# EasyEDA Pro project ProDoc_WCH-LinkW-R0-1v2_2024-12-16.epro

# Schematic WCH-LinkW-R0-1v2
Board Name: WCH-LinkW-R0-1v2; Create Date: 2024-08-13; Page Name: P1; Project Name: WCH_LINK; Schematic Name: WCH-LinkW-R0-1v2; Update Date: 2024-08-14; Company: 嘉立创EDA; Page Size: A3; Version: V1.0
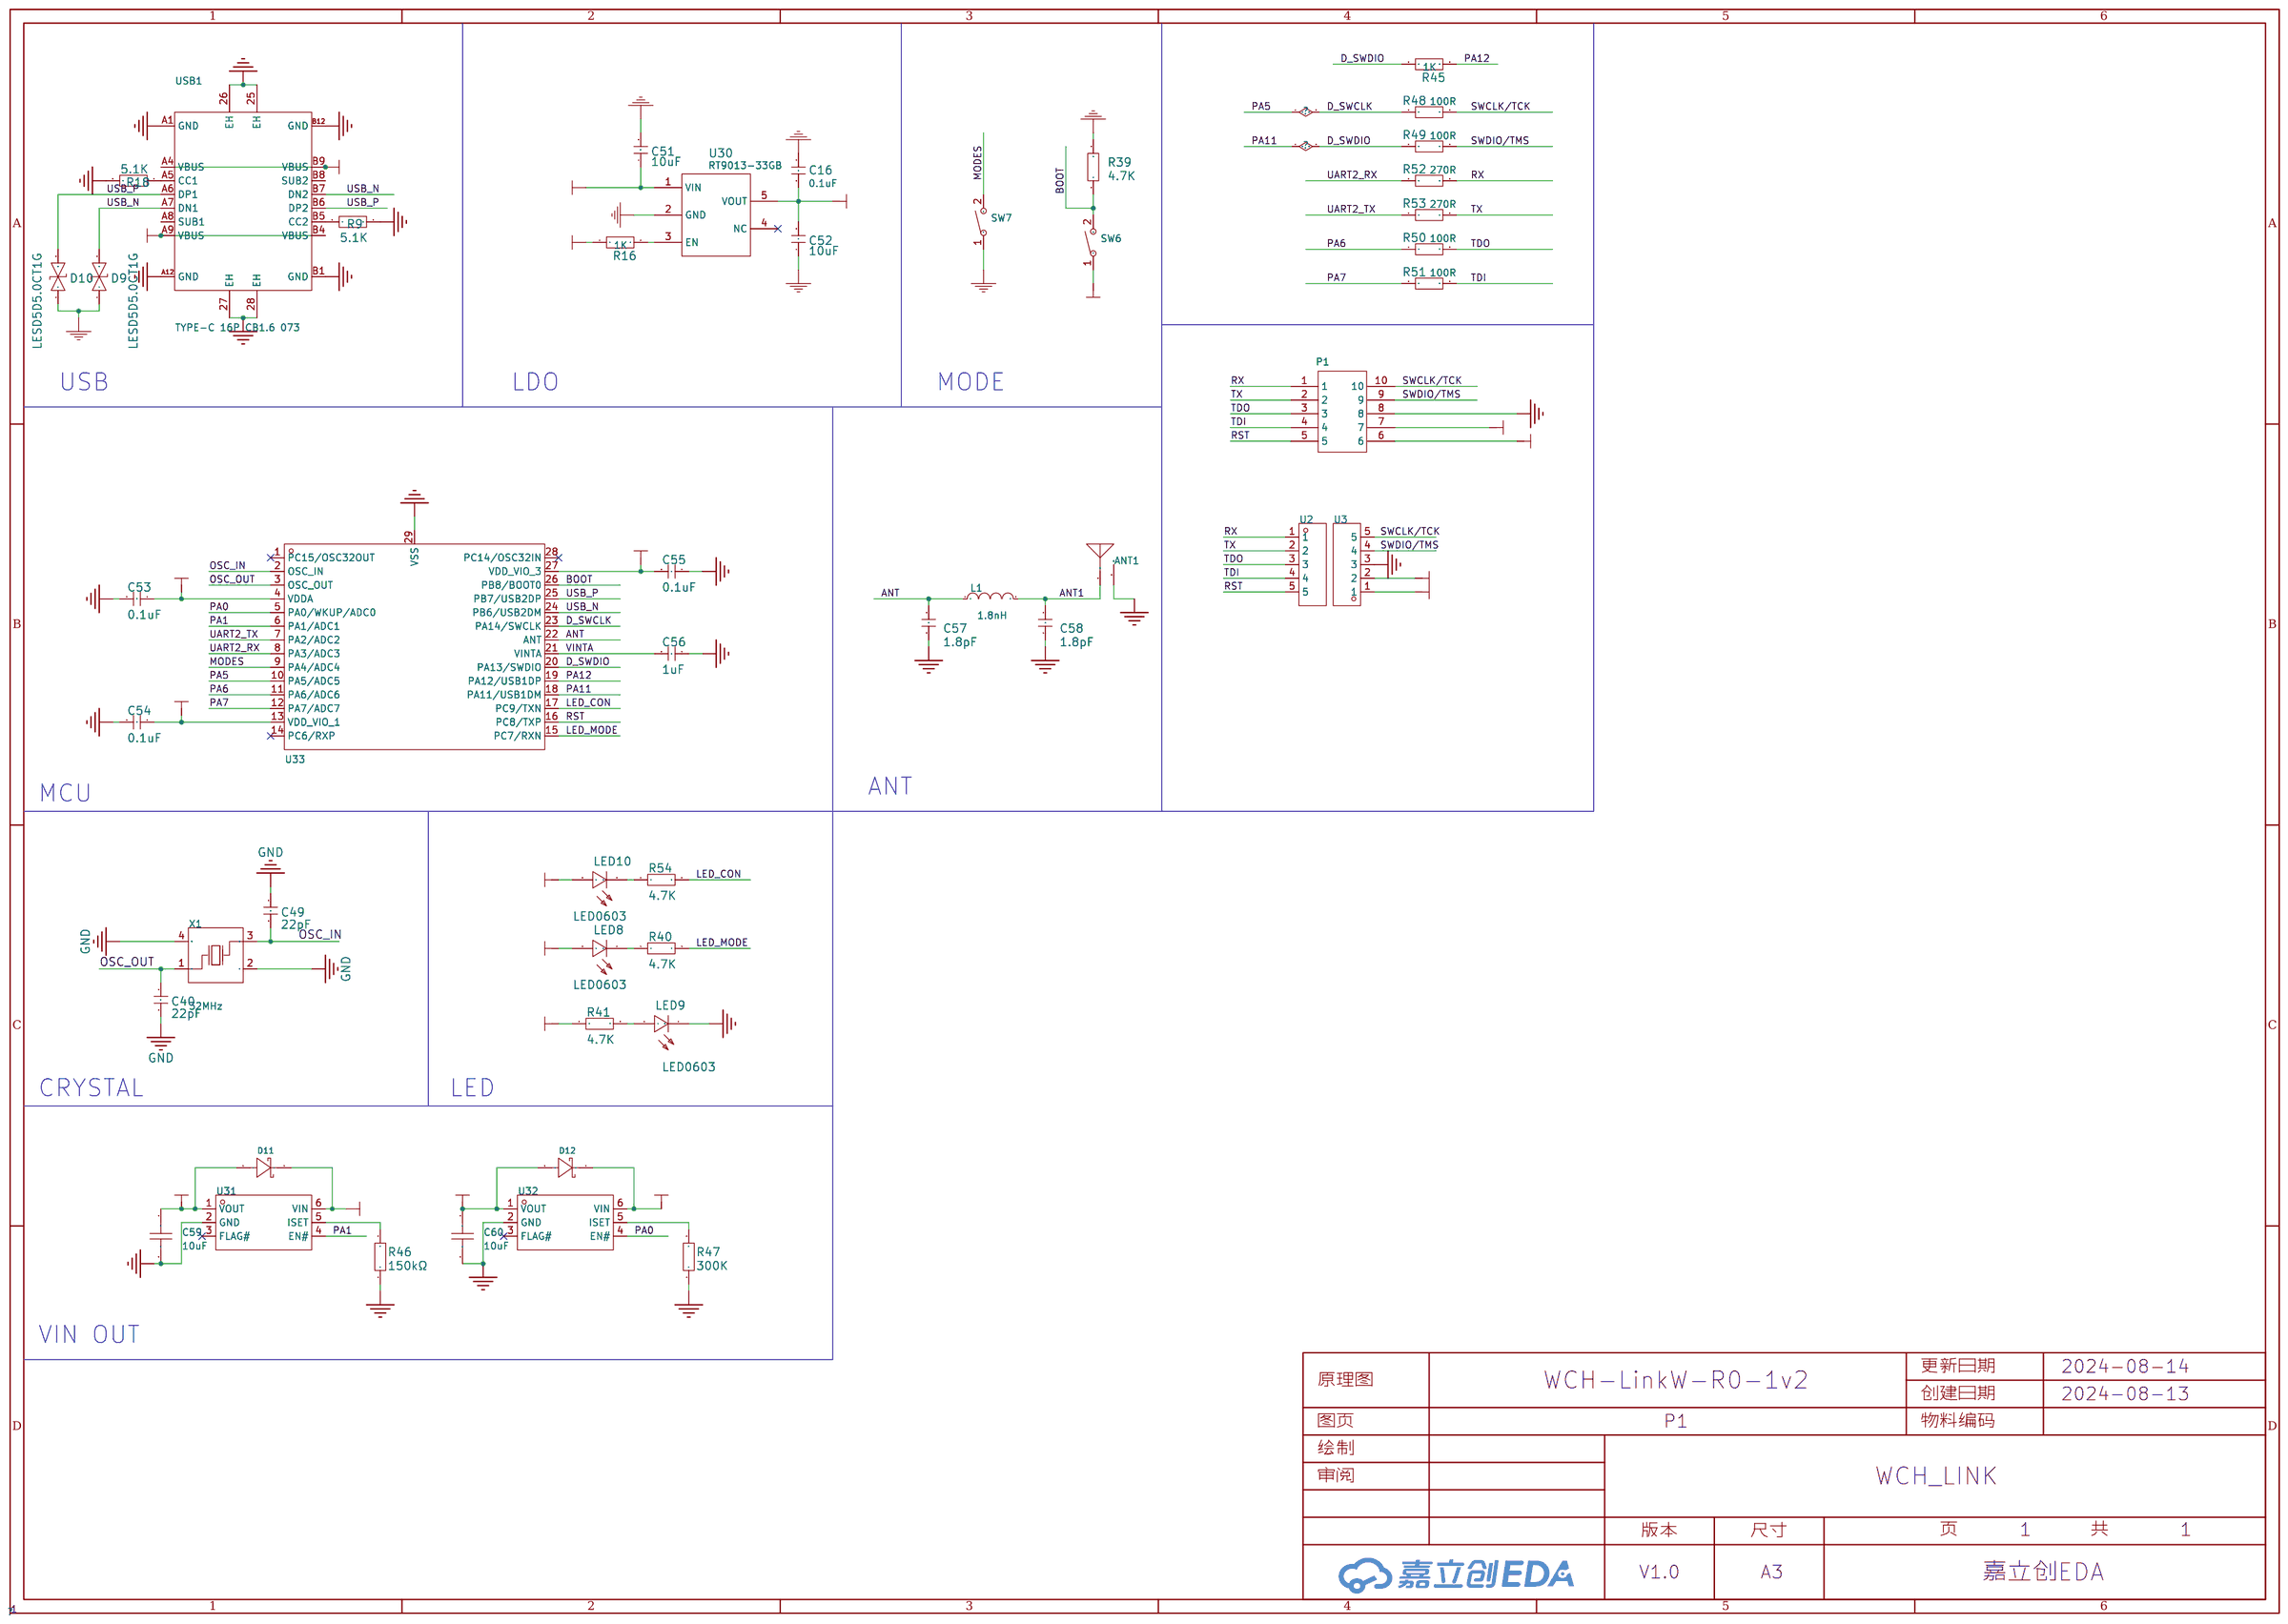
[diagram p0: schematic sheet]

## Parts
ANT1  -  [ANT-F-3-2.4G-1.6mmFR4-WCH]
C16  0.1uF  [c0603-1]
C40  22pF  [C0603-1]
C49  22pF  [C0603-1]
C51  10uF  [C0603-1]
C52  10uF  [C0603-1]
C53  0.1uF  [C0603-1]
C54  0.1uF  [C0603-1]
C55  0.1uF  [C0603-1]
C56  1uF  [C0603-1]
C57  1.8pF  [C0603-1]
C58  1.8pF  [C0603-1]
C59  10uF  [C0603]
C60  10uF  [C0603]
D9  LESD5D5.0CT1G  [SOD-523_L1.2-W0.8-LS1.6-BI]
D10  LESD5D5.0CT1G  [SOD-523_L1.2-W0.8-LS1.6-BI]
D11  B0520WS  [SOD-323_L1.7-W1.3-LS2.6-RD-1]
D12  B0520WS  [SOD-323_L1.7-W1.3-LS2.6-RD-1]
L1  1.8nH  [IND-SMD_L1.8-W1.1]
LED8  LED0603  [LED0603]
LED9  LED0603  [LED0603]
LED10  LED0603  [LED0603]
P1  -  [MZ_HDR_2.54_2*4]
R9  5.1K  [R0603-1]
R16  1K  [R0603-1]
R18  5.1K  [R0603-1]
R39  4.7K  [R0603-1]
R40  4.7K  [R0603-1]
R41  4.7K  [R0603-1]
R45  1K  [R0603-1]
R46  150kΩ  [R0603]
R47  300K  [R0603-1]
R48  100R  [R0603-1]
R49  100R  [R0603-1]
R50  100R  [R0603-1]
R51  100R  [R0603-1]
R52  270R  [R0603-1]
R53  270R  [R0603-1]
R54  4.7K  [R0603-1]
SW6  UK-B0273-SP25Y  [SW-SMD_L3.9-W2.9-P4.15-LS5.0]
SW7  UK-B0273-SP25Y  [SW-SMD_L3.9-W2.9-P4.15-LS5.0]
U2  X6511WVS-05H-C60D48R2  [HDR-SMD_5P-P2.54-H-M]
U3  X6511WVS-05H-C60D48R2  [HDR-SMD_5P-P2.54-H-M]
U30  RT9013-33GB  [SOT-23-5_L3.0-W1.7-P0.95-LS2.8-BR]
U31  CH217K  [SOT-23-6_L2.9-W1.6-P0.95-LS2.8-BL]
U32  CH217K  [SOT-23-6_L2.9-W1.6-P0.95-LS2.8-BL]
U33  CH32V208GBU6  [QFN-28_L4.0-W4.0-P0.40-BL-EP2.8]
USB1  TYPE-C 16P CB1.6 073  [USB-C-SMD_SHOU_TYPE-C-16P-CB1.6]
X1  32MHz  [CRYSTAL-SMD_4P-L3.2-W2.5-BL]

## Library data of the parts
ANT1 = 2.4G天线
C16 = 0.1uF
C40 C49 = 0.1uF: 3DModel: C0603_L1.6-W0.8-H0.8
C51-C58 = 1uF: 3DModel: C0603_L1.6-W0.8-H0.8
C59 C60 = CL10A106MA8NRNC: 容值:10uF;精度:±20%;额定电压:25V;材质(温度系数):X5R;; LCSC Part Name: 10uF ±20% 25V; Supplier Part: C96446; Manufacturer: SAMSUNG(三星); Supplier Footprint: 0603; JLCPCB Part Class: 基础库; Datasheet: https://atta.szlcsc.com/upload/public/pdf/source/20160218/1457707763339.pdf; Supplier: LCSC; Tolerance: ±20%; Voltage Rated: 25V; Temperature Coefficient: X5R
D9 D10 = LESD5D5.0CT1G: link: https://lcsc.com/product-detail/TVS_ESD5Z5V0C_C129211.html; 3DModel: SOD-523_L1.2-W0.8-H0.7-LS1.6; Supplier: LCSC; Supplier Part: C383211; Manufacturer: Leshan Radio; JLCPCB Part Class: Extended Part
D11 D12 = B0520WS_C7502696: 二极管配置:独立式;正向压降(Vf):390mV@500mA;直流反向耐压(Vr):20V;平均整流电流(Io):500mA;; LCSC Part Name: 电压:20V 电流:500mA; Supplier Part: C7502696; Manufacturer: 宏迦橙; Supplier Footprint: SOD-323; JLCPCB Part Class: Extended Part; Datasheet: https://atta.szlcsc.com/upload/public/pdf/source/20230828/D03BBC301FC735629C9CE389FB922DA4.pdf; Supplier: LCSC; Diode Configuration: 独立式; Forward Voltage (Vf@If): 390mV@500mA; Reverse Voltage (Vr): 20V; Average Rectified Current (Io): 500mA; Reverse Leakage Current (Ir): 250uA; Peak forward surge current: 5.5A
L1 = FHW0603UC1N8KST: 电感值:1.8nH;精度:±10%;额定电流:700mA;饱和电流(Isat):-;直流电阻(DCR):45mΩ;; LCSC Part Name: 1.8nH ±10%; Supplier Part: C317979; Manufacturer: FH(风华); Supplier Footprint: 0603; JLCPCB Part Class: 扩展库; Datasheet: https://atta.szlcsc.com/upload/public/pdf/source/20230223/9A251BBDEFC1735FFD270B60AF02944E.pdf; Supplier: LCSC; Tolerance: ±10%; Rated Current: 700mA; DC Resistance (DCR): 45mΩ; Q @ Freq: 16@250MHz; Frequency - Self Resonant: 12.5GHz
LED8-LED10 = LED0603: 3DModel: LED-0603_G
P1 = 2*5P 排针夹板 2.54
R9 R18 = 5.1K: 3DModel: R0603_L1.6-W0.8-H0.5
R16 R45 R48-R53 = 1K
R39-R41 R47 R54 = 4.7K: 3DModel: R0603_L1.6-W0.8-H0.5
R46 = 0603WAF1503T5E: 电阻类型:厚膜电阻;阻值:150kΩ;精度:±1%;功率:100mW;最大工作电压:75V;温度系数:±100ppm/℃;; LCSC Part Name: 150kΩ ±1% 100mW 厚膜电阻; Supplier Part: C22807; Manufacturer: UNI-ROYAL(厚声); Supplier Footprint: 0603; JLCPCB Part Class: 基础库; Datasheet: https://atta.szlcsc.com/upload/public/pdf/source/20200306/C422600_1E6D84923E4A46A82E41ADD87F860B5C.pdf; Supplier: LCSC; Type: 厚膜电阻; Tolerance: ±1%; Power(Watts): 100mW; Overload Voltage (Max): 75V; Temperature Coefficient: ±100ppm/℃; Operating Temperature Range: -55℃~+155℃
SW6 SW7 = UK-B0273-SP25Y: 触点电流:50mA;额定电压(AC):-;额定电压(DC):12V;额定功率:-;绝缘电阻:100MΩ;电路结构:单刀单掷;安装方式:立贴;带灯:无;作用力:250gf@±30gf;机械寿命:10万次;带支架:否;; LCSC Part Name: 3.9*2.9*2mm 立贴 轻触开关; Supplier Part: C493285; Manufacturer: USAKRO(美韩); Supplier Footprint: SMD; JLCPCB Part Class: 扩展库; Datasheet: https://atta.szlcsc.com/upload/public/pdf/source/20200316/C493285_638365E99AEC68F39349AA5AE0196036.pdf; Supplier: LCSC; Contact Current: 50mA; Voltage Rating (DC): 12V; Insulation Resistance: 100MΩ; Circuit: 单刀单掷; Mounting Style: 立贴; Actuator Style: 圆形按钮; Actuator/Cap Color: 黑色; With Lamp: 无; Operating Force: 250gf@±30gf; Mechanical Life: 10万次; Operating Temperature: -20℃~+70℃; Pin Style: SMD接片; Switch Length: 3.9mm; Switch Width: 2.9mm; Switch Height: 2mm; Strike Gundam: 否
U2 U3 = X6511WVS-05H-C60D48R2: 插针结构:1x5P;间距:2.54mm;行距:2.54mm;圆针/方针:方针;安装类型:-;排数:单排;总PIN位数:5P;额定电流:3A;额定电压:250V;配合针长度:-;塑高:2.5mm;端接针长度:-;触头材质:黄铜;触头镀层:金;工作温度范围:-40℃~+105℃;焊接温度(最大值):260℃;颜色:黑色;; LCSC Part Name: 1x5P 间距:2.54mm 方针; Supplier Part: C2883762; Manufacturer: XKB Connection(中国星坤); Supplier Footprint: SMD,P=2.54mm; JLCPCB Part Class: 扩展库; Datasheet: https://atta.szlcsc.com/upload/public/pdf/source/20200909/C780060_F941EB1B69F43B5D6329EAF74E2E27BB.pdf; Supplier: LCSC; Pin Structure: 1x5P; Pitch: 2.54mm; Row Spacing: 2.54mm; Circluar Pins/Square Pins: 方针; Number of Rows: 单排; Number of Pins: 5P; Current Rating (Max): 3A; Voltage Rating (Max): 250V; Insulation Height: 2.5mm; Contact Material: 黄铜; Contact Plating: 金; Operating Temperature Range: -40℃~+105℃; Soldering Temperature(Max): 260℃; Color: 黑色
U30 = RT9013-33GB: Supplier: LCSC; Manufacturer: RICHTEK; Supplier Part: C47773; JLCPCB Part Class: Extended Part
U31 U32 = CH217K: Supplier Part: C7462749; Supplier Footprint: SOT-23-6; JLCPCB Part Class: 扩展库; Supplier: LCSC
U33 = CH32V208GBU6: Supplier Part: C7434833; Manufacturer: WCH(南京沁恒); Supplier Footprint: QFN-28-EP(4x4); JLCPCB Part Class: 扩展库; Datasheet: https://atta.szlcsc.com/upload/public/pdf/source/20240411/5E05523CBB231C22A5C78C078317BD2C.pdf; Supplier: LCSC
USB1 = TYPE-C 16P CB1.6 073: 连接器类型:Type-C;标准:-;公母:母;端口数量:1;触点数量:16P;安装方式:沉板;额定电流 - 电源:3A;工作温度范围:-25℃~+85℃;; LCSC Part Name: Type-C 母 沉板; Supplier Part: C2906290; Manufacturer: SHOU HAN(首韩); Supplier Footprint: SMD; JLCPCB Part Class: Extended Part; Datasheet: https://atta.szlcsc.com/upload/public/pdf/source/20211021/35D048B933FA988260DD32545575C1A5.pdf; Supplier: LCSC; Connector Type: Type-C; Gender: 母; Number of Ports: 1; Number of Contacts: 16P; Mounting Style: 沉板; Current Rating - Power (Max): 3A; Operating Temperature Range: -25℃~+85℃
X1 = X322532MOB4SI: 晶振类型:贴片晶振;频率:32MHz;常温频差:±10ppm;外接负载电容:12pF;频率稳定度(全温):±20ppm;; LCSC Part Name: 32MHz ±10ppm 12pF; Supplier Part: C9009; Manufacturer: YXC(扬兴晶振); Supplier Footprint: SMD3225-4P; JLCPCB Part Class: 扩展库; Datasheet: https://atta.szlcsc.com/upload/public/pdf/source/20240329/19D5F850207469550BEB00D7DFEDBC7A.pdf; Supplier: LCSC; Crystal Type: 贴片晶振; Normal temperature Frequency Tolerance: ±10ppm; External load capacitor: 12pF; Frequency Stability(Full temperature range): ±20ppm; Operating Temperature: -40℃~+85℃

## Nets
3V3: C60.1 D12.2(A) P1.7 U3.2 U32.1(VOUT)
3V3_IN: C16.1 C52.2 C53.1 C54.1 C55.2 D12.1(K) LED8.2(A) LED10.2(A) R41.1 SW6.1 U30.5(VOUT) U32.6(VIN) U33.4(VDDA) U33.13(VDD_VIO_1) U33.27(VDD_VIO_3)
5V: C59.1 D11.2(A) P1.6 U3.1 U31.1(VOUT)
GND: ANT1.0(GND) C16.2 C40.1 C49.2 C51.2 C52.1 C53.2 C54.2 C55.1 C56.1 C57.2 C58.2 C59.2 C60.2 D9.1 D10.1 LED9.1(C) P1.8 R9.1 R18.2 R39.2 R46.1 R47.1 SW7.1 U3.3 U30.2(GND) U31.2(GND) U32.2(GND) U33.29(VSS) USB1.25(EH) USB1.26(EH) USB1.27(EH) USB1.28(EH) USB1.A1(GND) USB1.A12(GND) USB1.B1(GND) USB1.B12(GND) X1.2(GND) X1.4(GND)
VBUS: C51.1 D11.1(K) R16.1 U30.1(VIN) U31.6(VIN) USB1.A4(VBUS) USB1.A9(VBUS) USB1.B4(VBUS) USB1.B9(VBUS)
VINTA: C56.2 U33.21(VINTA)
ANT: C57.1 L1.1 U33.22(ANT)
ANT1: ANT1.1(ANT) C58.1 L1.2
BOOT: R39.1 SW6.2 U33.26(PB8/BOOT0)
D_SWCLK: R48.1 U33.10(PA5/ADC5) U33.23(PA14/SWCLK)
D_SWDIO: R45.1 R49.1 U33.18(PA11/USB1DM) U33.20(PA13/SWDIO)
LED_CON: R54.2 U33.17(PC9/TXN)
LED_MODE: R40.2 U33.15(PC7/RXN)
MODES: SW7.2 U33.9(PA4/ADC4)
OSC_IN: C49.1 U33.2(OSC_IN) X1.3(OSC2)
OSC_OUT: C40.2 U33.3(OSC_OUT) X1.1(OSC1)
PA0: U32.4(EN#) U33.5(PA0/WKUP/ADC0)
PA1: U31.4(EN#) U33.6(PA1/ADC1)
PA6: R50.1 U33.11(PA6/ADC6)
PA7: R51.1 U33.12(PA7/ADC7)
PA12: R45.2 U33.19(PA12/USB1DP)
RST: P1.5 U2.5 U33.16(PC8/TXP)
RX: P1.1 R52.2 U2.1
SWCLK/TCK: P1.10 R48.2 U3.5
SWDIO/TMS: P1.9 R49.2 U3.4
TDI: P1.4 R51.2 U2.4
TDO: P1.3 R50.2 U2.3
TX: P1.2 R53.2 U2.2
UART2_RX: R52.1 U33.8(PA3/ADC3)
UART2_TX: R53.1 U33.7(PA2/ADC2)
USB_N: D9.2 U33.24(PB6/USB2DM) USB1.A7(DN1) USB1.B7(DN2)
USB_P: D10.2 U33.25(PB7/USB2DP) USB1.A6(DP1) USB1.B6(DP2)
$1N1756: R16.2 U30.3(EN)
$1N1782: LED8.1(C) R40.1
$1N1786: LED9.2(A) R41.2
$1N1849: R46.2 U31.5(ISET)
$1N1850: R47.2 U32.5(ISET)
$1N2678: LED10.1(C) R54.1
$1N9716: R9.2 USB1.B5(CC2)
$1N9721: R18.1 USB1.A5(CC1)

Not connected (* = marked no-connect by the designer): U30 4(NC)*; U31 3(FLAG#)*; U32 3(FLAG#)*; U33 1(PC15/OSC32OUT)* 14(PC6/RXP)* 28(PC14/OSC32IN)*; USB1 A8(SUB1) B8(SUB2)

## Notes on the sheet
- USB
- LDO
- MODE
- MCU
- ANT
- CRYSTAL
- LED
- VIN OUT

# Board WCH-LinkW-R0-1v2
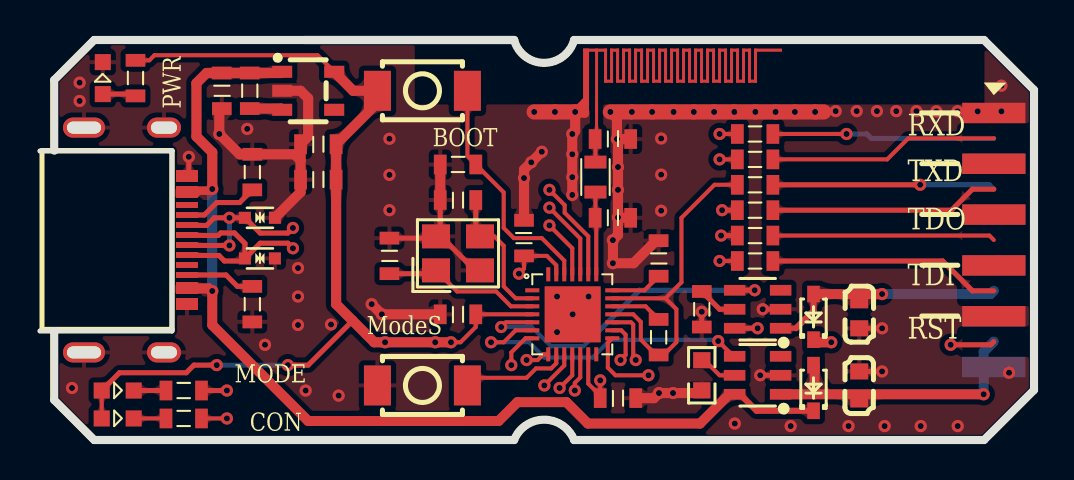
[diagram p1: board, top side]
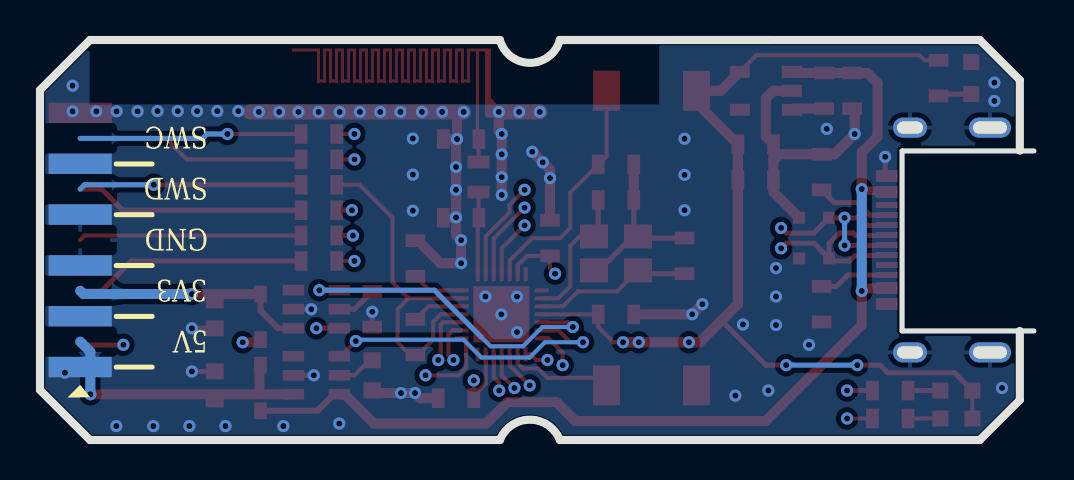
[diagram p2: board, bottom side, seen from below]

Outline 49.71 x 20 mm; copper layers: Top Layer, Inner1, Inner2, Bottom Layer. Coordinates in mm from the lower left corner of the outline.
Outline path: 0.71,14.47 0.71,18 2.71,20 23.71,20 ; 0.71,5.45 0.71,2 2.71,0 23.71,0 arc(25.21,1.02) 26.71,0 47.21,0 49.71,2.5 49.71,17.5 47.21,20 26.71,20 arc(25.21,18.86) 23.71,20 ; 23.71,20 13.21,20
Stack: Top Layer 0.035mm / Dielectric1 1.51mm FR4 er 4.5 / Inner1 0.035mm / Dielectric2 0.48mm PP er 4.5 / Inner2 0.035mm / Dielectric3 0.48mm PP er 4.5 / Bottom Layer 0.035mm

## Design rules (mm)
template: 自定义配置
spacing copperThickness1oz (default): track to track 0.152, other pairs 0.051 to 0.3
spacing copperThickness2oz: track to track 0.203, other pairs 0.152 to 0.3
track width copperThickness1oz (default): min 0.127, default 0.254, max 2.54
track width copperThickness2oz: min 0.203, default 0.254, max 2.54
differential pair differentialPair (default): width min 0.127, default 0.254, max 2.54; gap min 0.152, default 0.152
via viaSize (default): diameter min 0.5, default 0.61, max 10; hole min 0.3, default 0.305, max 6.299
pour e1214 uses 直连
pour e16 uses 直连

## Placement (name value [footprint] x y rotation side)
ANT1  -  [ANT-F-3-2.4G-1.6mmFR4-WCH]  27.83 16.82 0 top
C16  0.1uF  [c0603-1]  13.92 14.79 180 top
C40  22pF  [C0603-1]  17.48 9.2 270 top
C49  22pF  [C0603-1]  20.91 12 180 top
C51  10uF  [C0603-1]  9.09 17.46 270 top
C52  10uF  [C0603-1]  13.92 13.02 0 top
C53  0.1uF  [C0603-1]  20.91 6.28 180 top
C54  0.1uF  [C0603-1]  24.21 10.09 90 top
C55  0.1uF  [C0603-1]  28.91 2.09 180 top
C56  1uF  [C0603-1]  30.94 9.08 270 top
C57  1.8pF  [C0603-1]  28.65 11.11 0 top
C58  1.8pF  [C0603-1]  28.65 15.05 0 top
C59  10uF  [C0603]  40.97 2.73 90 top
C60  10uF  [C0603]  40.97 6.28 270 top
D9  LESD5D5.0CT1G  [SOD-523_L1.2-W0.8-LS1.6-BI]  11 11.11 180 top
D10  LESD5D5.0CT1G  [SOD-523_L1.2-W0.8-LS1.6-BI]  11 9.08 180 top
D11  B0520WS  [SOD-323_L1.7-W1.3-LS2.6-RD-1]  38.69 2.6 90 top
D12  B0520WS  [SOD-323_L1.7-W1.3-LS2.6-RD-1]  38.69 6.16 90 top
L1  1.8nH  [IND-SMD_L1.8-W1.1]  27.78 13.15 90 top
LED8  -  [LED0603]  3.89 1.08 180 top
LED9  -  [LED0603]  3.14 18.09 270 top
LED10  -  [LED0603]  3.89 2.47 180 top
R9  5.1K  [R0603-1]  10.62 6.79 90 top
R16  1K  [R0603-1]  10.49 17.46 270 top
R18  5.1K  [R0603-1]  10.62 13.4 90 top
R39  4.7K  [R0603-1]  20.91 13.78 180 top
R40  4.7K  [R0603-1]  7.19 1.08 0 top
R41  4.7K  [R0603-1]  4.78 18.09 270 top
R45  1K  [R0603-1]  30.94 5.14 90 top
R46  150kΩ  [R0603]  33.1 3.24 90 top
R47  300K  [R0603-1]  33.1 6.54 90 top
R48  100R  [R0603-1]  35.76 15.3 0 top
R49  100R  [R0603-1]  35.76 12.76 0 top
R50  100R  [R0603-1]  35.76 10.22 0 top
R51  100R  [R0603-1]  35.76 8.95 0 top
R52  270R  [R0603-1]  35.76 14.03 0 top
R53  270R  [R0603-1]  35.76 11.49 0 top
R54  4.7K  [R0603-1]  7.19 2.47 0 top
SW6  UK-B0273-SP25Y  [SW-SMD_L3.9-W2.9-P4.15-LS5.0]  19.13 17.46 0 top
SW7  UK-B0273-SP25Y  [SW-SMD_L3.9-W2.9-P4.15-LS5.0]  19.13 2.73 0 top
U2  X6511WVS-05H-C60D48R2  [HDR-SMD_5P-P2.54-H-M]  47.7 10 270 top
U3  X6511WVS-05H-C60D48R2  [HDR-SMD_5P-P2.54-H-M]  47.7 10 90 bottom
U30  RT9013-33GB  [SOT-23-5_L3.0-W1.7-P0.95-LS2.8-BR]  13.41 17.46 180 top
U31  CH217K  [SOT-23-6_L2.9-W1.6-P0.95-LS2.8-BL]  35.89 3.24 90 top
U32  CH217K  [SOT-23-6_L2.9-W1.6-P0.95-LS2.8-BL]  35.89 6.54 90 top
U33  CH32V208GBU6  [QFN-28_L4.0-W4.0-P0.40-BL-EP2.8]  26.62 6.28 270 top
USB1  TYPE-C 16P CB1.6 073  [USB-C-SMD_SHOU_TYPE-C-16P-CB1.6]  4.78 10 270 top
X1  32MHz  [CRYSTAL-SMD_4P-L3.2-W2.5-BL]  20.91 9.33 0 top

## Footprints (pads in the part's own frame, mm; a bottom-side part is the same pattern mirrored in y, then rotated)
ANT-F-3-2.4G-1.6mmFR4-WCH
  rect 0.1x0.1 smd: 0(-0.525,0) 1(0,0)
C0603
  rect 0.8x0.9 smd: 1(-0.7,0) 2(0.7,0)
C0603-1
  rect 0.635x0.98 smd: 1(-0.889,0) 2(0.889,0)
c0603-1
  rect 0.635x0.981 smd: 1(-0.889,0) 2(0.889,0)
CRYSTAL-SMD_4P-L3.2-W2.5-BL
  rect 1.4x1.2 smd: 1(-1.1,-0.85) 2(1.1,-0.85) 3(1.1,0.85) 4(-1.1,0.85)
HDR-SMD_5P-P2.54-H-M
  rect 1.02x3.16 smd: 1(-6.35,0) 2(-3.81,0) 3(-1.27,0) 4(1.27,0) 5(3.81,0)
IND-SMD_L1.8-W1.1
  rect 0.64x1.1 smd: 1(-0.75,0) 2(0.75,0)
LED0603
  rect 0.8x0.8 smd: 1(-0.8,0) 2(0.8,0)
QFN-28_L4.0-W4.0-P0.40-BL-EP2.8
  rect 0.2x0.7 smd: 1(-1.2,-2) 2(-0.8,-2) 3(-0.4,-2) 4(-0.001,-2) 5(0.4,-2) 6(0.8,-2) 7(1.2,-2) 15(1.2,2) 16(0.8,2) 17(0.4,2) 18(0,2) 19(-0.4,2) 20(-0.8,2) 21(-1.2,2)
  rect 0.7x0.2 smd: 8(2,-1.2) 9(2,-0.8) 10(2,-0.4) 11(1.999,0) 12(2,0.4) 13(2,0.8) 14(2,1.2) 22(-2,1.2) 23(-2,0.8) 24(-2,0.4) 25(-2,0) 26(-2,-0.4) 27(-2,-0.8) 28(-2,-1.2)
  rect 2.8x2.8 smd: 29(0.001,0.02)
R0603
  rect 0.806x0.864 smd: 1(-0.753,0) 2(0.753,0)
R0603-1
  rect 0.635x0.981 smd: 1(-0.889,0) 2(0.889,0)
SOD-323_L1.7-W1.3-LS2.6-RD-1
  rect 0.83x0.63 smd: 1(-1.14,0) 2(1.14,0)
SOD-523_L1.2-W0.8-LS1.6-BI
  rect 0.6x0.6 smd: 1(-0.75,0) 2(0.75,0)
SOT-23-5_L3.0-W1.7-P0.95-LS2.8-BR
  rect 1.001x0.6 smd: 1(1.3,-0.95) 2(1.3,0) 3(1.3,0.95) 4(-1.3,0.95) 5(-1.3,-0.95)
SOT-23-6_L2.9-W1.6-P0.95-LS2.8-BL
  rect 0.532x1.072 smd: 1(-0.95,-1.149) 2(0,-1.149) 3(0.95,-1.149) 4(0.95,1.149) 5(0,1.149) 6(-0.95,1.149)
SW-SMD_L3.9-W2.9-P4.15-LS5.0
  rect 1.35x2 smd: 1(-2.25,0) 2(2.25,0)
USB-C-SMD_SHOU_TYPE-C-16P-CB1.6
  oval 1x1.7 hole 0.6x1.3: 25(5.62,1.425) 28(-5.62,1.425)
  oval 1x2.1 hole 0.6x1.7: 26(5.62,-2.575) 27(-5.62,-2.575)
  rect 0.3x1.1 smd: A1(-3.35,2.575) A4(-2.55,2.575) A5(-1.25,2.575) A6(-0.25,2.575) A7(0.25,2.575) A8(1.25,2.575) A9(2.55,2.575) A12(3.35,2.575) B1(3.05,2.575) B4(2.25,2.575) B5(1.75,2.575) B6(0.75,2.575) B7(-0.75,2.575) B8(-1.75,2.575) B9(-2.25,2.575) B12(-3.05,2.575)

## Nets
As in the schematic.

Pads without a net: U30 4; U31 3; U32 3; U33 1 14 28; USB1 A8 B8

## Via types
v1: diameter 0.61, hole 0.305, Top Layer to Bottom Layer, 118 vias

## Routing (per net, layer and track width the routed paths; a pad name or vN(x,y) marks a point on that pad's centre or on a via; arc(x,y) is an arc through that point)
3V3: length 11.9
  Top Layer w0.254: U32.1 37.81,5.59
  Top Layer w0.305: D12.2 38.69,6.46 37.81,5.59
  Top Layer w0.5: v1(42.11,7.3) D12.2
  Bottom Layer w0.5: 47.7,7.46 47.54,7.3 42.11,7.3
3V3_IN: length 93.2
  Top Layer w0.203: U30.5 13.88,19.24 5.72,19.24 5.47,18.98 R41.1 ; v1(20.55,4.89) 21.03,4.89 21.79,5.65 C53.1 24.62,6.28 ; LED10.2 LED8.2 ; U33.13 27.42,2.82 28.02,2.22 ; C55.2 28.02,2.22 ; 28.02,2.22 v1(28.02,2.98) ; v1(23.95,8.32) 24.21,8.57 C54.1 25.35,9.2 25.82,8.73 U33.27
  Top Layer w0.254: v1(8.84,3.74) 7.7,3.74 7.32,3.36 3.98,3.36 LED10.2 ; 15.62,5.98 15.62,5.95 13.41,3.74 v1(12.4,3.74) ; U32.6 v1(35.89,5.59)
  Top Layer w0.5: v1(39.57,4.89) 38.82,4.89 D12.1
  Top Layer w0.508: v1(20.55,4.89) v1(19.76,4.89) v1(17.26,4.89) 16.71,4.89 14.81,6.79 C52.2 C16.1 16.88,16.86 SW6.1 15.66,17.46 U30.5
  Inner1 w0.508: v1(17.26,4.89) v1(19.76,4.89) v1(20.55,4.89) 23.62,1.82 23.63,1.84 26.24,1.84 26.62,1.46 28.02,1.46 ; v1(35.89,5.59) 35.9,5.58 35.9,4.12 ; 35.9,4.12 37.42,4.12 38.18,4.89 v1(39.57,4.89) ; 35.9,4.12 35.3,4.12 32.64,1.46 28.02,1.46 ; 28.02,1.46 v1(28.02,2.98)
  Inner2 w0.203: v1(20.55,4.89) 21.03,4.89 23.95,7.81 v1(23.95,8.32)
  Bottom Layer w0.254: v1(12.4,3.74) v1(8.84,3.74)
5V: length 14.5
  Top Layer w0.5: D11.2 38.74,3.69 38.74,2.29 ; 38.74,2.29 v1(47.19,2.29) ; 38.74,2.29 U31.1
  Bottom Layer w0.5: v1(47.19,2.29) 47.19,4.41 47.7,4.92
GND: length 70.3
  Top Layer w0.254: 19.8,10.18 20.05,10.18 21.76,8.48 X1.2 ; 19.8,10.18 19.72,10.09 C40.1 ; 19.8,10.18 20.02,10.39 C49.2 ; R47.1 v1(33.1,6.41) ; USB1.A1 7.44,13.44 v1(7.44,14.16) ; U32.2 v1(36.14,6.54) ; C59.2 v1(42.11,3.43) ; C60.2 v1(42.11,5.58) ; U31.2 v1(36.02,3.24)
  Top Layer w0.406: 27.26,16.32 26.85,16.32 v1(26.77,16.4) 27.26,16.89 27.26,16.32
  Top Layer w0.508: v1(16.59,6.79) v1(17.1,6.28) C53.2 ; 13.03,13.98 12.73,14.28 R18.2 9.98,14.28 v1(8.97,15.3) 8.97,16.44 C51.2 ; 13.03,13.98 C52.1 13.03,12.39 D9.1 ; 13.03,13.98 C16.2 13.41,15.17 13.41,17.08 13.03,17.46 U30.2 ; v1(28.52,16.4) 28.86,16.07 v1(28.86,15.05) ; v1(28.86,15.05) 28.91,15 v1(28.91,13.65) v1(28.91,12.51) v1(28.91,11.13) ; v1(28.86,15.05) C58.2 ; v1(28.91,11.13) 28.91,10.25 v1(28.65,9.99) v1(28.65,8.84) 29.68,8.84 30.81,9.97 C56.1 ; v1(28.91,11.13) 28.92,11.11 C57.2 ; v1(25.1,14.41) v1(24.57,13.88) 24.21,13.52 v1(24.21,13.1) 24.21,10.98 ; 33.1,2.35 v1(31.66,2.35) v1(30.96,2.35) 30.7,2.09 C55.1 ; v1(26.62,12.25) v1(26.62,13.14) v1(26.62,14.28) v1(26.62,15.3) 26.77,15.45 v1(26.77,16.4) ; R39.2 C49.2
  Top Layer w0.762: v1(24.71,16.4) v1(25.75,16.4) v1(26.77,16.4) 26.77,16.4 ; 39.19,16.4 v1(38.76,16.4) v1(37.75,16.4) v1(36.79,16.4) v1(35.78,16.4) v1(34.72,16.4) v1(33.71,16.4) v1(32.7,16.4) v1(31.69,16.4) v1(30.61,16.4) v1(29.6,16.4) v1(28.52,16.4)
  vias: v1(1.6,2.6) v1(1.98,17.87) v1(1.98,16.95) v1(10.36,15.56) v1(11.25,4.76) v1(12.9,8.6) v1(12.9,7.17) v1(12.9,5.75) v1(13.29,2.47) v1(14.55,5.78) v1(14.94,2.22) v1(17.48,15.06) v1(17.48,13.26) v1(17.48,11.49) v1(25.86,7.17) v1(25.86,5.39) v1(26.64,6.28) v1(27.44,7.17) v1(31.07,15.07) v1(31.07,13.27) v1(31.07,11.46) v1(34.75,0.82) v1(37.54,0.7) v1(39.79,16.44) v1(40.44,0.7) v1(40.84,16.44) v1(41.86,16.44) v1(42.24,0.7) v1(42.82,16.44) v1(43.83,16.44) v1(44.05,0.7) v1(44.83,16.43) v1(45.88,16.43) v1(45.9,0.7) v1(46.9,16.43) v1(48.08,17.72) v1(48.08,16.43) v1(48.46,3.36)
VBUS: length 56
  Top Layer w0.254: USB1.B9 7.82,12.25 7.95,12.38 8.45,12.38 v1(8.62,12.55) ; USB1.A4 8.61,12.55 ; USB1.A9 v1(8.62,7.45)
  Top Layer w0.305: v1(8.62,7.45) 8.69,7.45 8.46,7.68 7.58,7.68 ; D11.1 35.84,1.46 35.01,2.29 U31.6
  Top Layer w0.5: v1(8.62,7.45) 8.62,5.75 13.41,0.95 22.94,0.95 23.88,1.89 26.33,1.89 27.4,0.82 33.01,0.82 34.47,2.29 U31.6
  Top Layer w0.508: 8.62,12.55 8.62,14.38 7.82,15.17 7.82,17.84 8.33,18.35 C51.1 R16.1 12.05,18.35 U30.1
  Bottom Layer w0.5: v1(8.62,12.55) v1(8.62,7.45)
VINTA: length 2.6
  Top Layer w0.203: U33.21 30.23,7.48 C56.2
ANT: length 4.1
  Top Layer w0.203: U33.22 27.82,11.05 C57.1 27.78,11.13 L1.1
ANT1: length 3.2
  Top Layer w0.152: ANT1.1 27.83,14.78
  Top Layer w0.203: C58.1 27.78,15.03 L1.2
BOOT: length 12
  Top Layer w0.203: SW6.2 21.38,14.19 R39.1 23.19,12.38 23.19,10.6 23.7,10.09 25.1,10.09 26.22,8.97 U33.26
D_SWCLK: length 39.4
  Top Layer w0.203: v1(25.22,2.73) 26.22,3.72 U33.10 ; v1(25.48,12.51) 26.24,11.75 26.24,11.36 27.42,10.18 U33.23 ; v1(33.99,15.3) 34.88,15.3
  Inner1 w0.203: v1(25.48,12.51) 24.84,11.87 24.84,4.38 25.22,4 v1(25.22,2.73)
  Inner2 w0.203: v1(25.22,2.73) 23.19,2.73 22.81,3.11 22.81,3.95 23.5,4.63 25.04,4.63 25.3,4.89 25.3,5.63 25.63,5.95 26.09,5.95 26.32,5.73 26.87,5.73 33.22,12.08 33.22,14.54 v1(33.99,15.3)
D_SWDIO: length 17.8
  Top Layer w0.203: 34.88,12.76 33.73,12.76 32.08,11.11 32.08,7.88 31.28,7.08 ; U33.18 29.67,6.28 30.05,5.9 30.05,5.01 30.81,4.25 R45.1 31.19,4.25 31.83,4.89 31.83,6.54 31.28,7.08 ; 31.28,7.08 U33.20
LED_CON: length 26.8
  Top Layer w0.203: U33.17 29.56,5.88 29.67,5.78 29.67,4.12 v1(29.8,4)
  Top Layer w0.254: R54.2 v1(9.35,2.47)
  Inner2 w0.203: v1(9.35,2.47) 10.28,2.47 11.17,1.58 22.13,1.58 22.51,1.97 26.47,1.97 26.67,1.76 28.58,1.76 29.8,2.98 v1(29.8,4)
LED_MODE: length 27.5
  Top Layer w0.203: R40.2 v1(9.35,1.08) ; v1(30.43,3.24) 28.78,3.24 28.4,3.62 28.4,4.86 U33.15
  Inner2 w0.203: v1(9.35,1.08) 9.91,1.08 10.04,1.2 22.25,1.2 22.63,1.58 26.34,1.58 26.72,1.2 28.78,1.2 30.43,2.85 v1(30.43,3.24)
MODES: length 5.4
  Top Layer w0.203: U33.9 25.82,3.83 25.57,3.58 24.8,3.58 24.33,3.11 21.76,3.11 SW7.2
OSC_IN: length 7
  Top Layer w0.203: X1.3 22.72,10.18 23.19,9.71 23.19,7.68 23.79,7.08 U33.2
  Top Layer w0.254: X1.3 21.79,10.39 C49.1
OSC_OUT: length 8
  Top Layer w0.203: U33.3 23.55,6.68 22.81,7.43 20.86,7.43 19.8,8.48
  Top Layer w0.254: C40.2 19.64,8.32 19.8,8.48
PA0: length 16.9
  Top Layer w0.203: U33.5 23.3,5.88 v1(23.06,5.65)
  Top Layer w0.254: U32.4 v1(35.74,7.49)
  Bottom Layer w0.203: 27.65,5.15 27.18,4.68 25.55,4.68 24.59,5.65 v1(23.06,5.65)
  Bottom Layer w0.254: 27.65,5.15 29.98,7.49 v1(35.74,7.49)
PA1: length 15.5
  Top Layer w0.203: v1(22.56,4.89) 23.19,4.89 23.79,5.48 U33.6 ; v1(33.92,4.95) 34.68,4.19 U31.4
  Bottom Layer w0.203: v1(22.56,4.89) 24.46,4.89 25.22,4.12 27.64,4.12 28.52,5.01 33.85,5.01 v1(33.92,4.95)
PA6: length 14
  Top Layer w0.203: 26.62,4.28 26.62,3.24 v1(25.98,2.6)
  Top Layer w0.254: 34.88,10.22 v1(34.06,10.22)
  Inner2 w0.203: v1(25.98,2.6) 33.61,10.22 v1(34.06,10.22)
PA7: length 12.9
  Top Layer w0.203: U33.12 27.02,3.13 26.75,2.86 v1(26.75,2.47) ; v1(33.99,8.95) 34.88,8.95
  Inner2 w0.203: v1(26.75,2.47) 26.75,2.76 32.94,8.95 v1(33.99,8.95)
PA12: length 2.6
  Top Layer w0.203: U33.19 30.28,6.68 R45.2
RST: length 24.2
  Top Layer w0.203: v1(29.03,4) 29.29,4.25 29.29,5.27 29.07,5.48 U33.16
  Top Layer w0.254: v1(45.54,4.76) 47.54,4.76 47.7,4.92
  Inner2 w0.203: v1(45.54,4.76) 42.11,8.19 32.94,8.19 29.03,4.29 v1(29.03,4)
RX: length 11.5
  Top Layer w0.203: R52.2 42.37,14.03 43.42,15.08 47.7,15.08
SWCLK/TCK: length 11.1
  Top Layer w0.203: R48.2 v1(40.34,15.3)
  Bottom Layer w0.254: 47.7,15.08 41.57,15.08 41.35,15.3 v1(40.34,15.3)
SWDIO/TMS: length 11.1
  Top Layer w0.254: R49.2 v1(44.02,12.76)
  Bottom Layer w0.254: v1(44.02,12.76) 47.48,12.76 47.7,12.54
TDI: length 11.7
  Top Layer w0.254: 47.7,7.46 46.63,7.46 45.14,8.95 R51.2
TDO: length 11.1
  Top Layer w0.203: 47.7,10 47.48,10.22 R50.2
TX: length 11.5
  Top Layer w0.254: 47.7,12.54 46.63,12.54 45.58,11.49 R53.2
UART2_RX: length 17
  Top Layer w0.203: U33.8 25.17,4.28 24.89,4 v1(24.33,4) ; 34.88,14.03 v1(33.99,14.03)
  Inner2 w0.203: v1(33.99,14.03) 33.99,12.15 25.83,4 v1(24.33,4)
UART2_TX: length 16.6
  Top Layer w0.203: U33.7 24.28,5.08 23.57,4.38 v1(23.57,3.74)
  Top Layer w0.254: 34.88,11.49 34.29,11.49
  Inner2 w0.203: v1(23.57,3.74) 23.95,3.36 25.98,3.36 v1(34.11,11.49)
USB_N: length 30
  Top Layer w0.203: v1(25.48,11.62) 27.02,10.08 U33.24
  Top Layer w0.254: 7.35,10.73 8.33,10.73 8.71,11.11 v1(9.48,11.11) D9.2 11.01,10.35 12.4,10.35 v1(12.65,10.6) ; 7.35,9.73 v1(9.48,9.73)
  Inner2 w0.203: v1(12.65,10.6) 13.16,10.6 13.41,10.35 14.92,10.35 arc(15.1,10.42) 15.17,10.6 15.17,10.76 arc(15.42,11.01) 15.67,10.76 15.67,10.6 arc(15.92,10.35) 16.17,10.6 16.17,10.76 arc(16.42,11.01) 16.67,10.76 16.67,10.6 arc(16.92,10.35) 17.17,10.6 17.17,10.68 arc(17.42,10.93) 17.67,10.68 17.67,10.6 arc(17.74,10.42) 17.92,10.35 arc(18.09,10.42) 18.16,10.59 arc(18.23,10.76) 18.4,10.83 18.42,10.83 arc(18.59,10.76) 18.66,10.59 arc(18.73,10.42) 18.9,10.35 21.03,10.35 22.43,11.75 25.35,11.75 v1(25.48,11.62)
  Bottom Layer w0.254: v1(9.48,9.73) v1(9.48,11.11)
USB_P: length 30
  Top Layer w0.203: U33.25 26.62,9.59 v1(25.48,10.73)
  Top Layer w0.254: 7.35,9.23 8.95,9.23 9.22,8.95 10.12,8.95 D10.2 ; D10.2 11.01,9.84 12.4,9.84 v1(12.65,9.59) ; D10.2 10.25,9.83 9.72,10.35 9.04,10.35 8.91,10.23 7.35,10.23
  Inner2 w0.203: v1(12.65,9.59) 13.16,9.59 13.41,9.84 15.79,9.84 arc(15.97,9.77) 16.04,9.59 16.04,9.44 arc(16.29,9.19) 16.54,9.44 16.54,9.59 arc(16.79,9.84) 17.04,9.59 17.04,9.44 arc(17.29,9.19) 17.54,9.44 17.54,9.59 arc(17.79,9.84) 18.04,9.59 18.04,9.44 arc(18.29,9.19) 18.54,9.44 18.54,9.59 arc(18.79,9.84) 19.04,9.59 19.04,9.47 arc(19.29,9.22) 19.54,9.47 19.54,9.59 arc(19.62,9.77) 19.79,9.84 21.16,9.84 22.68,11.36 24.84,11.36 v1(25.48,10.73)
$1N1756: length 1.6
  Top Layer w0.508: U30.3 12.05,16.57 R16.2
$1N1782: length 1.6
  Top Layer w0.203: LED8.1 R40.1
$1N1786: length 1.7
  Top Layer w0.254: LED9.2 4.69,17.3 R41.2
$1N1849: length 2
  Top Layer w0.203: 33.1,4.12 33.99,3.24 U31.5
$1N1850: length 2
  Top Layer w0.254: 33.1,7.43 33.99,6.54 U32.5
$1N2678: length 1.6
  Top Layer w0.254: LED10.1 R54.1
$1N9716: length 3.5
  Top Layer w0.254: R9.2 9.87,7.68 9.3,8.25 USB1.B5
$1N9721: length 3.8
  Top Layer w0.254: R18.1 9.98,11.87 8.84,11.87 8.22,11.25 USB1.A5

## Copper pours and planes (outline as drawn; the poured copper is in the pictures)
GND on Top Layer: -4.24,23.94 51,23.94 51,-1.21 -4.24,-1.21
GND on Top Layer: 11.13,17.84 13.16,17.84 13.16,17.08 11.13,17.08
GND on Bottom Layer: -0.43,21.27 51.26,21.27 51.26,-0.83 -0.43,-0.83
GND on Inner1: -3.61,23.49 57.1,23.49 57.1,-4.57 -3.61,-4.57
GND on Inner2: -5.77,25.27 59.39,25.27 59.39,-6.73 -5.77,-6.73
VBUS on Top Layer: 8.6,11.94 8.6,12.55 5.58,12.55 5.16,12.13 5.16,7.55 5.54,7.17 8.59,7.17 8.59,7.74 6.62,7.74 6.17,8.19 6.17,11.49 6.68,12 8.54,12

Small or netless copper shapes (teardrops, artwork), in the pictures only: 228 on Top Layer, 18 on Bottom Layer, 10 on Inner1, 17 on Inner2

## Text on the board
Bottom Solder Mask Layer: WCH-LinkW-R0-1v2
Bottom Silkscreen Layer: SWD | GND | SWC | 5V | 3V3
Document Layer: 二维码麻烦添加在PCB背面
Top Silkscreen Layer: ModeS | BOOT | PWR | MODE | CON | RXD | TXD | TDO | TDI | RST
